# EAGLE board uSlices_v3 (EAGLE 9.3.1)
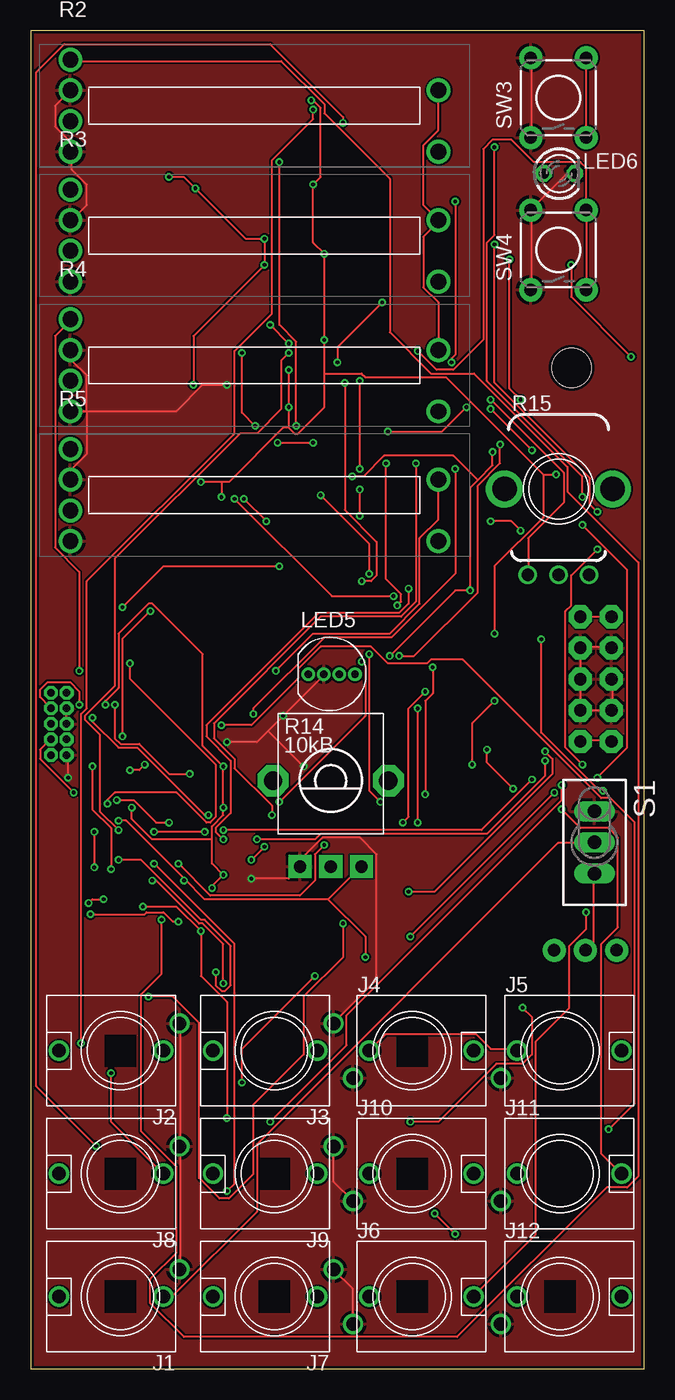
[diagram p3: board, top side]
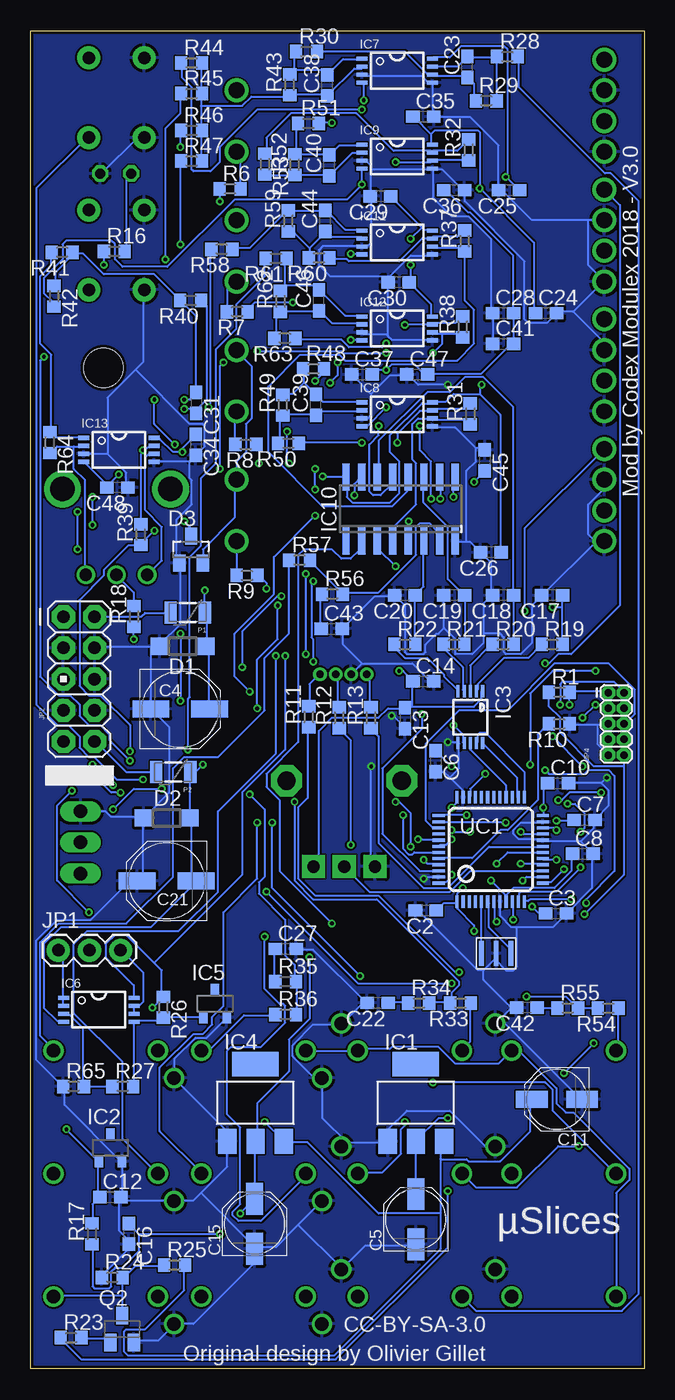
[diagram p4: board, bottom side, seen from below]

Size 50 x 109 mm. Coordinates in mm from the lower left corner, seen from the top.
Outline: 0,0 50,0 50,109 0,109 0,0
Copper layers (1*16): Top 0.035mm / dielectric 1.5mm / Bottom 0.035mm
Design rules "dirt_cheap_dirty_boards.v1.1": minimum track width 6mil, minimum drill 12mil, track to track 6mil, track to pad 6mil, pad to pad 6mil, via to via 6mil, smd to smd 0mil, copper to edge 10mil, drill to drill 10mil, minimum pad ring 10mil, minimum via ring 6mil, stop-mask expansion 2mil, vias tented up to drill 25mil, thermal gap 10mil
Holes 3.2 mm at 44.07,81.53

## Footprints (pad centres in the part's own frame; a part is rotated, then mirrored left to right if it is on the bottom)
C0603 = smd 1.1 x 1: 1 -0.85,0; 2 0.85,0
PANASONIC_D = smd 3 x 1.4: + 2.4,0; - -2.4,0
PANASONIC_C = smd 2.6 x 1.4: + 2.05,0; - -2.05,0
SOD123 = smd 1.4 x 1.4: A 1.9,0; C -1.9,0
SOT23 = smd 1 x 1.4: 1 -0.95,-1.1; 2 0.95,-1.1; 3 0,1.1
SOT223 = smd 1.499 x 2.007: 1 -2.261,-3.15; 2 0.025,-3.15; 3 2.311,-3.15 | smd 3.81 x 2.007: 4 0,3.15
DBZ_R-PDSO-G3 = smd 0.7 x 1: 1 -0.95,-1.1; 2 0.95,-1.1; 3 0,1.1
MSOP10 = smd 0.25 x 1: 1 -1,-2.113; 2 -0.5,-2.113; 3 0,-2.113; 4 0.5,-2.113; 5 1,-2.113; 6 1,2.113; 7 0.5,2.113; 8 0,2.113; 9 -0.5,2.113; 10 -1,2.113
TSSOP-8 = smd 0.9 x 0.35: 1 -2.875,0.975; 2 -2.875,0.325; 3 -2.875,-0.325; 4 -2.875,-0.975; 5 2.875,-0.975; 6 2.875,-0.325; 7 2.875,0.325; 8 2.875,0.975
SOIC16N = smd 0.6 x 2.2: 1 -4.445,-2.6; 2 -3.175,-2.6; 3 -1.905,-2.6; 4 -0.635,-2.6; 5 0.635,-2.6; 6 1.905,-2.6; 7 3.175,-2.6; 8 4.445,-2.6; 9 4.445,2.6; 10 3.175,2.6; 11 1.905,2.6; 12 0.635,2.6; 13 -0.635,2.6; 14 -1.905,2.6; 15 -3.175,2.6; 16 -4.445,2.6
INSTRUO_S_JACK_S2_INV = drill 1.1: GND 2.223,-4.826; NORM 0,-3.5; TIP 0,5
1X03 = drill 1.016 pad 1.88: 1 0,0; 2 2.54,0; 3 5.08,0
AVR_ICSP = drill 1.016 pad 1.88 octagon: 1 -1.27,5.08; 2 1.27,5.08; 3 -1.27,2.54; 4 1.27,2.54; 5 -1.27,0; 6 1.27,0; 7 -1.27,-2.54; 8 1.27,-2.54; 9 -1.27,-5.08; 10 1.27,-5.08
2X5-1.27 = drill 0.61 pad 1.067 octagon: 1 -1.27,3.81; 2 0,3.81; 3 -1.27,2.54; 4 0,2.54; 5 -1.27,1.27; 6 0,1.27; 7 -1.27,0; 8 0,0; 9 -1.27,-1.27; 10 0,-1.27
LED-TRICOLOR-THROUGHHOLE = drill 0.6: BLU 0.635,0; GND -0.635,0; GRN 1.905,0; RED -1.905,0
LED3MM = drill 0.813 octagon: A -1.27,0; K 1.27,0
PTC-1206 = smd 1 x 1.8: 1 -1.4,0; 2 1.4,0
INSTRUO_CRYSTAL_SMALLER = smd 0.4 x 2: GND 0,0; X1 -1.2,0; X2 1.2,0
SOT23-BEC = smd 1 x 1.4: B -0.95,-1.1; C 0,1.1; E 0.95,-1.1
R0603 = smd 1 x 1.1: 1 -0.85,0; 2 0.85,0
PTL2010G0103B2 = drill 1.3 pad 1.95: 1 2.5,3.75; 2 2.5,1.25; 3 2.5,-1.25; 4 2.5,-3.75; 5 32.5,-3.75; 6 32.5,1.25
ALPS_POT_VERTICAL_PS = drill 1 pad 1.88 square: P$1 -2.5,7; P$2 0,7; P$3 2.5,7 | drill 1.5 pad 2.54 octagon: P$4 -4.7,0; P$5 4.7,0
INSTRUO_Q-POT2 = drill 1 pad 1.5: P$1 -2.5,-7; P$2 0,-7; P$3 2.5,-7 | drill 2 pad 2.5: P$4 -4.4,0; P$5 4.4,0
TL3XPO = drill 1.1 pad 1.422 long: 1 -2.54,0; 2 0,0; 3 2.54,0
SPARKFUN_TACTILE-PTH = drill 1.016 pad 1.88: 1 -3.251,2.261; 2 3.251,2.261; 3 -3.251,-2.261; 4 3.251,-2.261
LQFP48 = smd 0.254 x 1: 1 -2.75,-4.25; 2 -2.25,-4.25; 3 -1.75,-4.25; 4 -1.25,-4.25; 5 -0.75,-4.25; 6 -0.25,-4.25; 7 0.25,-4.25; 8 0.75,-4.25; 9 1.25,-4.25; 10 1.75,-4.25; 11 2.25,-4.25; 12 2.75,-4.25; 25 2.75,4.25; 26 2.25,4.25; 27 1.75,4.25; 28 1.25,4.25; 29 0.75,4.25; 30 0.25,4.25; 31 -0.25,4.25; 32 -0.75,4.25; 33 -1.25,4.25; 34 -1.75,4.25; 35 -2.25,4.25; 36 -2.75,4.25 | smd 1 x 0.254: 13 4.25,-2.75; 14 4.25,-2.25; 15 4.25,-1.75; 16 4.25,-1.25; 17 4.25,-0.75; 18 4.25,-0.25; 19 4.25,0.25; 20 4.25,0.75; 21 4.25,1.25; 22 4.25,1.75; 23 4.25,2.25; 24 4.25,2.75; 37 -4.25,2.75; 38 -4.25,2.25; 39 -4.25,1.75; 40 -4.25,1.25; 41 -4.25,0.75; 42 -4.25,0.25; 43 -4.25,-0.25; 44 -4.25,-0.75; 45 -4.25,-1.25; 46 -4.25,-1.75; 47 -4.25,-2.25; 48 -4.25,-2.75

## Placement (x,y rotation side)
C2  100n  [C0603]  17.8,37.34 180 bottom
C3  100n  [C0603]  7.2,37.09 0 bottom
C4  47u  [PANASONIC_D]  37.81,53.74 0 bottom
C5  22u  [PANASONIC_C]  18.61,12.18 90 bottom
C6  100n  [C0603]  17,49.5 270 bottom
C7  100n  [C0603]  4.87,44.71 0 bottom
C8  3.3u  [C0603]  5.01,41.95 0 bottom
C10  100n  [C0603]  7.02,47.71 0 bottom
C11  22u  [PANASONIC_C]  7.12,21.94 180 bottom
C12  470n  [C0603]  43.5,14 0 bottom
C13  100n  [C0603]  19.5,53 270 bottom
C14  3.3u  [C0603]  18,56 0 bottom
C15  22u  [PANASONIC_C]  31.75,11.81 90 bottom
C16  100n  [C0603]  42,11 270 bottom
C17  1u  [C0603]  7.5,63 180 bottom
C18  1u  [C0603]  11.5,63 180 bottom
C19  1u  [C0603]  15.5,63 180 bottom
C20  1u  [C0603]  19.5,63 180 bottom
C21  47u  [PANASONIC_D]  38.92,39.74 180 bottom
C22  560p  [C0603]  21.73,29.8 180 bottom
C23  18p  [C0603]  14.41,106.03 90 bottom
C24  100n  [C0603]  8,86 0 bottom
C25  100n  [C0603]  11,96 180 bottom
C26  100n  [C0603]  12.5,66.5 180 bottom
C27  560p  [C0603]  29.22,34.21 0 bottom
C28  100n  [C0603]  11.5,86 0 bottom
C29  100n  [C0603]  21.5,95.5 180 bottom
C30  100n  [C0603]  20,88.5 180 bottom
C31  560p  [C0603]  36.52,78.68 270 bottom
C34  100n  [C0603]  36.55,75.27 270 bottom
C35  100n  [C0603]  18,102 0 bottom
C36  100n  [C0603]  15.5,96 180 bottom
C37  100n  [C0603]  23,81 0 bottom
C38  18p  [C0603]  25.83,104.53 90 bottom
C39  18p  [C0603]  26.75,78.53 90 bottom
C40  18p  [C0603]  25.67,98.03 90 bottom
C41  100n  [C0603]  11.5,83.5 0 bottom
C42  560p  [C0603]  9.57,29.42 180 bottom
C43  560p  [C0603]  25.47,60.29 0 bottom
C44  18p  [C0603]  26,93.5 90 bottom
C45  100n  [C0603]  13,74 270 bottom
C46  18p  [C0603]  26.51,87.03 90 bottom
C47  100n  [C0603]  18.5,81 0 bottom
C48  100n  [C0603]  42.92,71.79 180 bottom
D1  1N5819HW  [SOD123]  37.61,58.86 180 bottom
D2  1N5819HW  [SOD123]  38.91,44.86 0 bottom
D3  BAT54S  [SOT23]  36.93,66.74 0 bottom
IC1  LM1117-3.3  [SOT223]  18.63,21.68 0 bottom
IC2  LM4040B25  [DBZ_R-PDSO-G3]  43.5,18 0 bottom
IC3  DAC124S085CIMT  [MSOP10]  14.17,53.09 180 bottom
IC4  LM1117-3.3  [SOT223]  31.7,21.68 0 bottom
IC5  LM4040B10  [DBZ_R-PDSO-G3]  34.98,29.74 0 bottom
IC6  TL072TSSOP  [TSSOP-8]  44.45,29.24 0 bottom
IC7  TL072TSSOP  [TSSOP-8]  20.13,105.74 0 bottom
IC8  TL072TSSOP  [TSSOP-8]  20.13,77.74 0 bottom
IC9  TL072TSSOP  [TSSOP-8]  20.13,98.74 0 bottom
IC10  V2164SZ  [SOIC16N]  19.86,70.04 0 bottom
IC11  TL072TSSOP  [TSSOP-8]  20.13,91.74 0 bottom
IC12  TL072TSSOP  [TSSOP-8]  20.13,84.74 0 bottom
IC13  TL072TSSOP  [TSSOP-8]  42.81,74.86 0 bottom
J1  [INSTRUO_S_JACK_S2_INV]  7.31,5.88 90 top
J2  [INSTRUO_S_JACK_S2_INV]  7.31,25.91 90 top
J3  [INSTRUO_S_JACK_S2_INV]  19.86,25.91 90 top
J4  [INSTRUO_S_JACK_S2_INV]  31.09,25.91 270 top
J5  [INSTRUO_S_JACK_S2_INV]  43.14,25.91 270 top
J6  [INSTRUO_S_JACK_S2_INV]  31.09,5.88 270 top
J7  [INSTRUO_S_JACK_S2_INV]  19.86,5.88 90 top
J8  [INSTRUO_S_JACK_S2_INV]  7.31,15.89 90 top
J9  [INSTRUO_S_JACK_S2_INV]  19.86,15.89 90 top
J10  [INSTRUO_S_JACK_S2_INV]  31.09,15.89 270 top
J11  [INSTRUO_S_JACK_S2_INV]  43.14,15.89 270 top
J12  [INSTRUO_S_JACK_S2_INV]  43.14,5.88 270 top
JP1  [1X03]  47.75,34.09 0 bottom
JP2  M05X2PTH  [AVR_ICSP]  46.06,56.18 0 bottom
JP4  M05X2MINIJTAG  [2X5-1.27]  1.66,51.27 0 bottom
LED5  WP154A4SUREQBFZG  [LED-TRICOLOR-THROUGHHOLE]  24.52,56.58 0 top
LED6  [LED3MM]  43.07,97.37 0 top
P1  PTCSMD  [PTC-1206]  37.2,61.61 180 bottom
P2  PTCSMD  [PTC-1206]  38.38,48.61 180 bottom
Q1  8MHz  [INSTRUO_CRYSTAL_SMALLER]  12.07,33.84 0 bottom
Q2  MMBT3904  [SOT23-BEC]  42.55,3.24 0 bottom
R1  10k  [R0603]  6.93,55.11 0 bottom
R2  PTL20-10G0-103B2  [PTL2010G0103B2]  0.74,102.89 0 top
R3  PTL20-10G0-103B2  [PTL2010G0103B2]  0.74,92.32 0 top
R4  PTL20-10G0-103B2  [PTL2010G0103B2]  0.74,81.74 0 top
R5  PTL20-10G0-103B2  [PTL2010G0103B2]  0.74,71.17 0 top
R6  100  [R0603]  33.75,96.11 0 bottom
R7  100  [R0603]  33.17,86.11 180 bottom
R8  100  [R0603]  32.48,75.29 180 bottom
R9  100  [R0603]  32.38,64.62 180 bottom
R10  10k  [R0603]  6.93,52.53 180 bottom
R11  100  [R0603]  27.33,53.11 90 bottom
R12  100  [R0603]  24.85,53.03 90 bottom
R13  100  [R0603]  22.27,53.03 90 bottom
R14  10kB  [ALPS_POT_VERTICAL_PS]  24.45,47.91 180 top
R15  10kB CD  [INSTRUO_Q-POT2]  43.01,71.67 0 top
R16  100  [R0603]  43.19,91.03 0 bottom
R17  510  [R0603]  45,11 90 bottom
R18  100k  [R0603]  41.57,61.29 90 bottom
R19  100  [R0603]  7.5,59 0 bottom
R20  100  [R0603]  11.5,59 0 bottom
R21  100  [R0603]  15.5,59 0 bottom
R22  100  [R0603]  19.5,59 0 bottom
R23  10k  [R0603]  46.71,2.53 0 bottom
R24  3.3k  [R0603]  43.35,7.45 0 bottom
R25  4.7k  [R0603]  38.27,8.45 0 bottom
R26  4.7k  [R0603]  39.19,29.45 270 bottom
R27  100k  [R0603]  42.5,23 0 bottom
R28  1.0k  [R0603]  11.16,106.88 0 bottom
R29  100k  [R0603]  12.87,103.29 0 bottom
R30  100k  [R0603]  27.52,107.29 0 bottom
R31  100k  [R0603]  14.17,77.79 90 bottom
R32  100k  [R0603]  14.32,99.29 90 bottom
R33  100k  [R0603]  14.97,29.79 180 bottom
R34  510  [R0603]  18.38,29.79 0 bottom
R35  510  [R0603]  29.22,31.53 0 bottom
R36  100k  [R0603]  29.22,28.87 0 bottom
R37  100k  [R0603]  14.64,91.87 90 bottom
R38  100k  [R0603]  14.79,84.87 90 bottom
R39  1.0k  [R0603]  41.03,67.95 90 bottom
R40  33k  [R0603]  36.97,87.03 180 bottom
R41  100k  [R0603]  47.44,90.95 180 bottom
R42  240k  [R0603]  48.09,87.37 270 bottom
R43  49.9k  [R0603]  28.9,104.59 90 bottom
R44  100k  [R0603]  36.89,106.37 0 bottom
R45  100k  [R0603]  36.89,103.87 0 bottom
R46  100k  [R0603]  36.89,100.87 0 bottom
R47  100k  [R0603]  36.89,98.37 0 bottom
R48  1.0k  [R0603]  26.95,81.45 0 bottom
R49  100k  [R0603]  29.45,78.5 90 bottom
R50  100k  [R0603]  29,75.38 180 bottom
R51  1.0k  [R0603]  27.37,101.45 0 bottom
R52  100k  [R0603]  28.5,98.09 90 bottom
R53  100k  [R0603]  30.91,98.12 270 bottom
R54  100k  [R0603]  2.94,29.37 180 bottom
R55  510  [R0603]  6.24,29.37 0 bottom
R56  510  [R0603]  25.41,63.11 0 bottom
R57  100k  [R0603]  28.09,65.87 0 bottom
R58  1.0k  [R0603]  34.43,91.2 180 bottom
R59  100k  [R0603]  29,93.5 90 bottom
R60  100k  [R0603]  26.5,90.5 180 bottom
R61  1.0k  [R0603]  30,90.46 180 bottom
R62  100k  [R0603]  29.64,86.95 90 bottom
R63  100k  [R0603]  29.29,83.95 180 bottom
R64  100k  [R0603]  48.44,75.45 270 bottom
R65  100k  [R0603]  46.5,23 0 bottom
S1  TL32PO  [TL3XPO]  45.94,42.88 270 top
SW3  [SPARKFUN_TACTILE-PTH]  43.01,103.54 90 top
SW4  [SPARKFUN_TACTILE-PTH]  43.01,91.14 90 top
UC1  STM32F103CBT6  [LQFP48]  12.51,42.31 0 bottom

## Tracks (layer width: path | path; a pad name or v marks a point on that pad's centre or on a via)
+3V3  (via drill 0.3)
  Top 0.152: v14.78,39.17 14.78,39.32 v15.7,40.23 14.78,41.15 14.78,43.13 | 14.78,43.13 14.78,44.2 15.7,45.11 v15.7,45.72 v15.7,49.07 14.02,50.75 14.02,58.22 9.91,62.33 9.6,62.33 7.16,59.89 7.16,55.47 6.1,54.41 v6.1,54.1 | v9.14,37.64 11.89,37.64 v13.87,35.66 13.87,32 16,29.87 v16,20.42 | v8.23,45.72 8.23,44.81 9.91,43.13 14.78,43.13
  Bottom 0.152: C5.+ 18.59,14.33 18.59,18.44 IC1.2 18.59,18.59 16.76,20.42 v16,20.42 | JP4.1 3.05,55.17 5.94,55.17 R1.2 6.1,55.02 v6.1,54.1 | UC1.24 8.23,45.11 v8.23,45.72 8.23,47.4 7.92,47.7 C10.1 | 15.24,37.95 16.31,37.95 16.92,37.34 C2.1 | 15.24,37.95 UC1.1 | v15.7,40.23 15.7,40.08 16.15,39.62 16.61,39.62 UC1.48 | v14.78,39.17 15.24,38.71 15.24,38.1 UC1.1 | v15.7,45.72 15.24,46.18 15.24,46.48 UC1.36 | v9.14,37.64 8.69,37.19 8.08,37.19 C3.1 | v13.87,35.66 13.87,36.12 15.24,37.49 15.24,37.95 | 15.24,37.95 UC1.1 | v15.7,49.07 16.92,50.29 C6.1
+3V3_A  (via drill 0.3)
  Top 0.152: R4.6 33.22,83.06 33.22,86.87 32,88.09 32,92.2 33.22,93.42 R3.6 33.22,93.57 32,94.79 32,99.67 33.22,100.89 33.22,104.09 R2.6 | v32.92,12.65 v34.59,10.97 | v7.16,44.65 7.77,44.65 12.5,39.93 | 12.5,39.93 14.17,38.25 24.23,38.25 | 24.23,38.25 26.82,40.84 R14.P$1 | 12.5,39.93 v12.5,39.78 | v27.28,33.53 27.28,35.2 24.23,38.25 | v19.96,56.84 23.01,59.89 29.26,59.89 31.7,62.33 31.7,67.67 33.22,69.19 33.22,72.39 R5.6
  Bottom 0.152: D3.2 35.97,65.68 35.97,66.75 33.38,69.34 33.38,72.39 R5.6 33.22,72.54 33.22,73.91 32.46,74.68 32.46,76.96 32,77.42 32,81.69 33.22,82.91 R4.6 | 41.15,10.97 41.91,11.73 C16.1 | 41.15,10.97 41.15,9.6 42.52,8.23 43.13,8.23 43.43,7.92 43.43,6.71 43.59,6.55 44.81,6.55 44.96,6.71 44.96,10.06 R17.1 | v34.59,10.97 41.15,10.97 | v32.92,12.65 31.85,13.72 C15.+ 31.7,13.87 31.7,18.44 IC4.2 31.55,18.59 31.55,21.64 28.96,24.23 28.96,26.82 27.28,28.5 v27.28,33.53 | 11.28,38.56 11.28,38.1 UC1.9 11.28,38.56 | 11.28,38.56 10.67,39.17 7.32,39.17 5.94,40.54 5.94,41.91 C8.1 | 18.9,53.95 19.36,53.95 C13.1 19.51,53.8 20.88,53.8 21.64,53.03 25.45,53.03 26.52,51.97 26.52,41.3 26.82,41 R14.P$1 | 18.9,53.95 13.87,53.95 13.26,54.56 13.26,55.17 IC3.1 | 18.9,53.95 18.9,55.93 C14.1 18.9,56.08 19.66,56.84 v19.96,56.84 | v7.16,44.65 5.79,44.65 C7.1 | v12.5,39.78 11.28,38.56
ADD_SWITCH  (via drill 0.3)
  Top 0.152: v14.17,43.74 v10.06,43.74 | v15.7,43.89 36.73,43.89 v40.84,48.01 | SW3.4 45.26,106.68 45.26,100.43 SW3.3
  Bottom 0.152: v10.06,43.74 9.91,43.59 8.38,43.59 UC1.21 | v14.17,43.74 15.54,43.74 v15.7,43.89 | v40.84,48.01 42.98,48.01 44.81,49.84 45.26,49.84 46.02,50.6 46.02,51.51 46.94,52.43 47.85,52.43 49.53,54.1 49.53,96.16 45.41,100.28 SW3.3
AREF_2.5  (via drill 0.3)
  Top 0.152: v15.54,52.43 17.98,52.43 21.79,56.24 21.79,57 23.62,58.83 27.74,58.83 29.11,57.45 32.31,57.45 32.61,57.76 35.2,57.76 46.48,46.48 47.24,46.48 49.23,44.5 49.23,21.64 v47.09,19.51
  Bottom 0.152: v15.54,52.43 14.78,51.66 14.78,51.05 IC3.7 | v47.09,19.51 44.5,16.92 IC2.1 44.5,16.76 44.5,14.02 C12.1 44.5,13.87 44.96,13.41 44.96,11.89 R17.2
AREF_5
  Bottom 0.152: IC6.2 47.4,29.57 47.4,30.18 IC6.1 47.4,30.33 47.4,33.68 47.7,33.98 JP1.1
AREF_10
  Bottom 0.152: IC6.6 41.6,28.96 41.6,29.41 IC6.7 41.45,29.57 41.15,29.57 40.84,29.87 40.84,32.31 42.52,33.98 JP1.3
AREF_10_0
  Bottom 0.152: IC5.1 35.97,28.65 39.17,28.65 R26.2 39.32,28.5 39.47,28.35 41.45,28.35 IC6.5 41.6,28.19 41.6,23.01 R27.2
BOOT_FLASH
  Bottom 0.152: UC1.44 16.61,41.6 14.02,41.6 11.73,43.89 11.12,43.89 8.69,46.33 8.69,51.66 7.92,52.43 R10.2
DAC_MOSI
  Bottom 0.152: UC1.28 11.28,46.63 11.28,47.55 14.17,50.44 14.17,50.9 IC3.8
DAC_SCK
  Bottom 0.152: UC1.26 10.36,46.63 10.36,48.16 13.11,50.9 IC3.10
DAC_SS
  Bottom 0.152: UC1.25 9.75,46.63 9.75,48.62 12.95,51.82 13.41,51.82 13.56,51.66 13.56,51.05 IC3.9
DEL_SWITCH  (via drill 0.3)
  Top 0.152: v7.16,43.89 5.64,45.41 5.64,51.66 4.42,52.88 4.42,53.19 6.86,55.63 6.86,65.99 17.07,76.2 18.44,76.2 20.42,78.18 20.42,82.14 v21.03,82.75 | v31.55,82.91 33.07,81.38 34.44,81.38 36.88,83.82 36.88,99.36 37.64,100.13 39.17,100.13 41,98.3 44.81,98.3 45.26,97.84 45.26,94.49 SW4.4 45.26,94.34 45.26,87.94 SW4.3
  Bottom 0.152: v7.16,43.89 7.32,44.04 8.23,44.04 UC1.22 | v21.03,82.75 24.54,82.75 24.69,82.91 v31.55,82.91
FB_CURRENT  (via drill 0.3)
  Top 0.152: v9.6,30.33 11.58,30.33 13.72,28.19 13.72,15.54 15.39,13.87 16.15,13.87 18.14,15.85 18.14,21.49 22.25,25.6 22.25,30.33 25.45,33.53 v25.45,36.27
  Bottom 0.152: R54.2 3.81,29.41 5.33,29.41 R55.2 5.49,29.41 6.4,30.33 v9.6,30.33 | v25.45,36.27 29.72,40.54 29.72,46.33 30.79,47.4 30.79,48.46 28.19,51.05 28.19,66.29 27.74,66.75 25.45,66.75 24.69,65.99 23.93,65.99 23.16,66.75 23.16,67.36 IC10.2
FB_CURRENT1  (via drill 0.3)
  Top 0.152: v28.5,46.18 27.58,47.09 v27.58,58.22 | v27.58,64.77 27.58,67.21 v23.62,71.17
  Bottom 0.152: R34.2 17.53,29.87 15.85,29.87 R33.2 15.7,29.87 15.7,30.63 15.09,31.24 15.09,31.55 21.79,38.25 26.98,38.25 28.5,39.78 v28.5,46.18 | v27.58,64.77 v27.58,58.22 | v23.62,71.17 23.62,72.08 23.16,72.54 IC10.15
FB_CURRENT2  (via drill 0.3)
  Top 0.152: v32.16,46.79 32.16,54.41 32.77,55.02 v32.77,57.15 | v29.57,62.94 24.54,62.94 v16.61,70.87
  Bottom 0.152: R36.2 28.35,28.96 28.35,31.39 R35.2 28.5,31.55 28.5,32.92 29.26,33.68 29.26,36.58 31.39,38.71 31.39,39.62 30.94,40.08 30.94,45.57 v32.16,46.79 | v32.77,57.15 32.77,60.05 29.87,62.94 v29.57,62.94 | v16.61,70.87 16.61,72.54 IC10.10
FB_CURRENT3
  Bottom 0.152: R57.2 27.28,65.84 24.69,63.25 R56.2 24.54,63.25 21.64,63.25 18.59,66.29 18.59,68.58 18.29,68.89 17.53,68.89 16.76,68.12 16.76,67.51 IC10.7
FRAME_CHANGE  (via drill 0.3)
  Top 0.152: v10.06,41.15 16.61,34.59 16.61,15.09 v16,14.48
  Bottom 0.152: v10.06,41.15 8.38,41.15 UC1.16 | v16,14.48 16,9.91 25.15,0.76 45.87,0.76 47.55,2.44 R23.1
GAIN_1  (via drill 0.3)
  Top 0.152: v20.27,65.38 10.82,65.38 v7.47,62.03
  Bottom 0.152: 6.71,62.03 6.71,62.94 C17.1 | 6.71,62.03 6.71,59.13 R19.2 | v20.27,65.38 21.64,66.75 21.64,67.36 IC10.3 | 6.71,62.03 v7.47,62.03
GAIN_2
  Bottom 0.152: R20.2 10.67,59.13 10.67,62.94 C18.1 10.67,63.09 10.67,78.33 13.11,80.77 14.63,80.77 15.85,79.55 17.68,79.55 21.64,75.59 21.64,72.69 IC10.14
GAIN_3
  Bottom 0.152: R21.2 14.63,59.13 14.63,62.94 C19.1 14.78,63.09 16,64.31 16,68.58 17.98,70.56 17.98,72.54 IC10.11
GAIN_4
  Bottom 0.152: R22.2 18.75,59.13 18.75,62.94 C20.1 18.59,63.09 17.98,63.7 17.98,67.36 IC10.6
GND  (via drill 0.3)
  Top 0.152: LED5.GND 23.93,56.54 v20.57,53.19 19.36,51.97 | v16,51.05 18.44,51.05 19.36,51.97 | R2.2 3.2,104.09 1.98,102.87 1.98,101.19 3.2,99.97 3.2,99.21 R2.4 3.35,99.06 3.35,97.69 4.57,96.47 4.57,94.79 3.35,93.57 R3.2 | v16,80.16 14.02,80.16 11.89,78.03 4.57,78.03 | 4.57,78.03 3.35,78.03 R4.4 | 4.57,78.03 4.57,80.92 3.35,82.14 3.35,82.91 R4.2 | 4.57,78.03 4.57,74.52 3.35,73.3 3.35,72.54 R5.2 | LED6.K 44.2,97.23 43.59,97.23 40.84,94.49 SW4.2 40.84,94.34 40.84,87.94 SW4.1 | SW3.2 40.84,106.68 40.84,100.43 SW3.1 | 44.81,53.65 44.81,56.08 JP2.6 44.81,56.24 44.81,58.67 JP2.4 44.81,58.83 47.24,58.83 JP2.3 | 44.81,53.65 JP2.8 44.81,53.65 | JP2.5 47.4,56.08 47.4,53.65 JP2.7 47.24,53.65 44.81,53.65 | JP4.3 2.9,53.8 2.9,52.58 JP4.5 | v3.05,48.16 3.05,49.99 JP4.9 | J1.GND 12.19,8.23 12.19,17.98 J8.GND 12.19,18.14 12.19,28.04 J2.GND | v17.98,39.93 21.03,39.93 21.95,40.84 R14.P$3 22.1,41 22.1,41.6 23.77,43.28 26.82,43.28 28.19,41.91 28.19,31.7 24.69,28.19 J3.GND | J6.GND 26.21,3.66 26.21,6.55 24.69,8.08 J7.GND | J9.GND 24.69,17.98 24.69,15.24 26.21,13.72 J10.GND | v22.25,49.07 19.36,51.97
  Bottom 0.152: 13.72,74.98 15.39,76.66 17.22,76.66 IC8.5 | 13.72,74.98 13.11,74.98 C45.1 | 16.31,60.35 16.31,62.94 C19.2 | 16.31,60.35 15.39,59.44 15.39,58.22 14.02,58.22 13.11,59.13 13.11,59.89 | 13.11,59.89 13.11,62.33 12.5,62.94 C18.2 12.5,63.09 12.5,65.68 13.26,66.45 C26.2 13.41,66.6 14.17,67.36 14.48,67.36 | 14.48,67.36 15.39,67.36 IC10.8 | 13.72,74.98 13.72,73.91 14.48,73.15 14.48,67.36 | 15.85,48.16 16.31,48.62 16.92,48.62 C6.2 | 15.85,48.16 14.78,47.09 14.78,46.63 UC1.35 | 15.85,48.16 15.09,48.92 15.09,50.9 IC3.6 15.24,51.05 v16,51.05 | 23.01,57.45 18.9,57.45 17.53,56.08 17.22,56.08 C14.2 | 23.01,57.45 23.77,56.69 LED5.GND | v20.57,53.19 20.42,53.19 19.51,52.27 C13.2 | 23.01,57.45 24.54,58.98 24.54,60.2 C43.2 24.54,60.35 21.95,62.94 20.42,62.94 C20.2 20.27,62.94 19.51,62.18 19.51,58.37 19.36,58.22 17.98,58.22 17.83,58.37 17.83,58.98 16.92,59.89 16.76,59.89 16.31,60.35 | IC7.3 22.86,105.31 18.14,105.31 17.68,104.85 17.37,104.85 IC7.5 17.22,104.7 17.22,102.11 C35.2 17.07,101.96 14.17,101.96 11.89,99.67 11.89,96.01 C25.2 11.73,95.86 11.43,95.86 9.14,93.57 4.57,93.57 | 4.57,93.57 3.35,93.57 R3.2 | 20.73,89 19.05,90.68 17.37,90.68 IC11.5 | 20.73,89 20.73,88.54 C30.2 20.88,88.39 20.88,84.12 | 20.88,84.12 21.03,84.28 22.86,84.28 IC12.3 | 20.88,84.12 20.57,83.82 17.37,83.82 IC12.5 | 22.25,97.69 22.25,95.56 C29.2 22.25,95.4 22.25,91.75 22.55,91.44 22.86,91.44 IC11.3 23.01,91.44 26.21,91.44 26.52,91.14 26.52,89.92 25.6,89 20.73,89 | 22.25,97.69 22.25,97.99 22.55,98.3 22.86,98.3 IC9.3 | C41.1 12.34,83.52 12.34,85.95 C28.1 12.5,86.11 12.5,92.05 14.33,93.88 15.7,93.88 17.22,95.4 17.22,97.69
  Bottom 0.152: 17.22,97.69 16.46,97.69 14.78,96.01 C36.1 14.63,95.86 14.63,95.1 9.75,90.22 9.75,85.5 9.45,85.19 7.92,85.19 7.16,85.95 C24.2 7.01,86.11 5.79,86.11 | 17.22,97.69 IC9.5 | 17.22,97.69 IC9.5 | 22.25,97.69 17.37,97.69 IC9.5 | 3.96,67.36 8.23,63.09 C17.2 8.38,62.94 9.14,62.18 9.14,59.13 10.06,58.22 11.28,58.22 11.43,58.37 11.43,59.59 11.73,59.89 13.11,59.89 | 3.96,67.36 3.35,67.36 R5.4 3.96,67.36 | 3.96,67.36 4.57,67.97 4.57,70.41 3.35,71.63 3.35,72.39 R5.2 | 5.79,86.11 3.35,88.54 R3.4 3.35,88.7 4.57,89.92 4.57,93.57 | 5.79,86.11 3.35,83.67 3.35,83.06 R4.2 | 22.25,79.4 22.25,77.72 22.55,77.42 22.86,77.42 IC8.3 | 22.25,79.4 23.77,80.92 C37.1 | 22.25,79.4 20.73,80.92 19.36,80.92 C47.1 19.2,80.92 18.44,80.16 v16,80.16 | SW3.1 40.84,100.28 41.3,100.28 44.2,97.38 LED6.K | 43.74,74.52 45.57,74.52 IC13.3 | 43.74,74.52 42.22,73 42.22,71.93 C48.1 | 43.74,74.52 43.74,79.1 41.45,81.38 | 41.45,81.38 40.84,81.99 40.84,87.78 SW4.1 | D2.C 40.84,44.81 40.84,40.23 41.3,39.78 C21.+ 41.45,39.62 42.06,39.62 45.11,36.58 47.85,36.58 49.53,34.9 49.53,25.15 47.4,23.01 R65.1 47.24,22.86 47.24,21.49 42.67,16.92 IC2.2 42.52,16.76 42.52,14.02 C12.2 | S1.1 45.87,45.41 43.89,45.41 43.43,44.96 40.84,44.96 D2.C | 37.03,73.91 39.93,73.91 IC13.5 | 37.03,73.91 36.58,74.37 C34.2 | 40.23,58.83 44.65,58.83 JP2.4 | 40.23,58.83 39.62,58.83 D1.A 39.47,58.98 37.8,60.66 37.8,65.53 D3.1 37.95,65.68 38.1,65.84 38.1,69.19 36.88,70.41 36.88,72.39 37.03,72.54 37.03,73.91 | 37.03,73.91 C34.2 | 40.23,58.83 40.23,53.8 C4.- 40.08,53.65 38.71,52.27 38.71,46.94 40.69,44.96 D2.C | 41.45,81.38 37.03,76.96 35.97,76.96 35.81,76.81 35.81,75.13 36.42,74.52 C34.2
  Bottom 0.152: 3.81,52.43 3.05,52.43 JP4.5 | 3.81,52.43 5.94,52.43 R10.1 | 3.81,52.43 3.81,50.9 3.05,50.14 JP4.9 | 10.36,35.97 7.47,35.97 6.4,37.03 C3.2 6.25,37.19 4.27,39.17 4.27,41.91 C8.2 4.27,42.06 5.18,42.98 | 10.36,35.97 10.82,35.97 11.73,36.88 11.73,37.95 UC1.8 | 5.18,42.98 8.23,42.98 UC1.20 8.38,43.13 10.21,43.13 10.67,43.59 10.67,43.89 10.06,44.5 8.38,44.5 UC1.23 | 5.18,42.98 4.12,44.04 4.12,44.65 C7.2 3.96,44.81 2.9,45.87 2.9,47.09 3.5,47.7 | 3.5,47.7 6.1,47.7 C10.2 | 3.5,47.7 v3.05,48.16 | 13.11,32.46 13.56,32.46 18.29,37.19 18.59,37.19 C2.2 | 12.19,33.38 13.11,32.46 | 12.19,33.38 12.19,33.83 Q1.GND 12.19,33.38 | 10.82,29.41 10.52,29.41 C42.2 10.82,29.41 | 11.73,28.5 12.04,28.19 J2.GND 11.73,28.5 | 11.73,28.5 10.82,29.41 | 11.73,28.5 5.18,21.95 C11.- | 13.11,32.46 13.11,31.7 10.82,29.41 | 10.36,35.97 10.36,32.77 10.67,32.46 11.28,32.46 12.19,33.38 | IC5.2 34.14,28.5 35.66,26.98 36.58,26.98 38.25,25.3 38.25,23.77 J5.GND 38.25,23.62 33.98,19.36 33.98,18.59 IC4.1 33.98,18.44 33.98,16.46 36.12,14.33 | R24.1 44.35,7.47 42.06,9.75 42.06,10.06 C16.2 42.06,10.21 42.06,10.52 42.82,11.28 42.82,13.72 42.67,13.87 C12.2 | C12.2 42.52,13.87 42.37,13.72 38.41,13.72 J11.GND 38.25,13.72 36.73,13.72 36.12,14.33 | v17.98,39.93 17.83,40.08 16.76,40.08 UC1.47 | C27.2 28.35,34.14 26.98,34.14 22.71,29.87 C22.2 22.71,29.72 23.01,29.72 24.54,28.19 J3.GND 24.69,28.04 26.98,28.04 28.65,26.36 28.65,25.45 26.98,23.77 26.36,23.77 J4.GND 26.21,23.62 26.21,20.42 24.23,18.44 | C5.- 18.75,10.06 22.71,10.06 24.54,8.23 J7.GND 24.69,8.23 28.19,11.73 | 24.23,18.44 21.03,18.44 IC1.1 20.88,18.59 20.88,19.51 19.36,21.03 15.85,21.03 12.95,18.14 12.19,18.14 J8.GND
  Bottom 0.152: 24.23,18.44 24.54,18.14 J9.GND 24.23,18.44 | Q2.E 41.45,2.29 39.62,2.29 38.41,3.5 J12.GND 38.25,3.66 36.73,3.66 31.85,8.53 31.85,9.75 C15.- | 31.7,9.91 30.02,9.91 28.19,11.73 | 28.19,11.73 26.36,13.56 J10.GND | 31.7,9.91 C15.- | 31.7,9.91 36.12,14.33 | 31.7,9.91 C15.- | v22.25,49.07 22.25,41.15 22.1,41 R14.P$3
  pour Top (isolate 0.012): 50,109 0,109 0,0 50,0
  pour Bottom (isolate 0.012): 50,109 0,109 0,0 50,0
IN_1
  Bottom 0.152: R54.1 2.13,29.26 2.13,26.21 2.29,26.06 J2.TIP
IN_2
  Bottom 0.152: R33.1 14.17,29.72 14.17,26.67 14.78,26.06 J3.TIP
IN_3
  Bottom 0.152: R36.1 30.18,28.8 32.61,28.8 35.36,26.06 35.97,26.06 J4.TIP
IN_4
  Bottom 0.152: R57.1 28.96,65.84 28.96,59.89 30.94,57.91 30.94,53.65 34.75,49.84 37.49,49.84 38.41,48.92 38.41,40.08 42.22,36.27 47.7,36.27 49.23,34.75 49.23,27.13 48.16,26.06 J5.TIP
JTCK  (via drill 0.3)
  Top 0.152: v14.48,45.11 14.17,45.11 8.69,50.6 7.16,50.6 5.03,52.73 v5.03,53.03 | v3.96,54.1 3.96,55.17 3.2,55.93 1.37,55.93 0.76,55.32 0.76,54.71 1.52,53.95 JP4.4
  Bottom 0.152: v14.48,45.11 16.61,45.11 UC1.37 | v3.96,54.1 v5.03,53.03
JTDI  (via drill 0.3)
  Top 0.152: v11.28,44.5 10.21,44.5 8.38,46.33 v7.01,46.33 | v3.5,46.94 0.76,49.68 0.76,50.44 1.52,51.21 JP4.8
  Bottom 0.152: v11.28,44.5 16.61,44.5 UC1.38 | v7.01,46.33 6.71,46.33 6.1,46.94 v3.5,46.94
JTDO
  Bottom 0.152: UC1.39 16.76,44.04 17.22,44.04 17.83,44.65 17.83,50.9 15.09,53.65 11.12,53.65 7.32,57.45 2.9,57.45 0.76,55.32 0.76,53.34 1.52,52.58 JP4.6
JTMS  (via drill 0.3)
  Top 0.152: v12.95,48.46 11.28,48.46 8.84,50.9 7.32,50.9 6.86,51.36 v6.86,54.1
  Bottom 0.152: v12.95,48.46 14.17,47.24 14.17,46.63 UC1.34 | v6.86,54.1 6.86,55.78 6.71,55.93 2.44,55.93 1.68,55.17 JP4.2
LED_B  (via drill 0.3)
  Top 0.152: v12.04,41.15 14.63,38.56 21.95,38.56 23.16,39.78 23.16,41.91 v23.93,42.67
  Bottom 0.152: v12.04,41.15 11.12,42.06 8.38,42.06 UC1.18 | v23.93,42.67 23.93,51.21 24.84,52.12 R12.1
LED_CH1  (via drill 0.3)
  Top 0.152: v18.14,53.34 18.14,53.8 23.93,59.59 29.41,59.59 34.59,64.77 v34.59,73.3 | v34.29,81.99 34.29,82.3 34.59,82.6 v34.59,95.1
  Bottom 0.152: v18.14,53.34 18.14,52.12 21.34,48.92 21.34,43.59 18.29,40.54 16.76,40.54 UC1.46 | v34.59,73.3 34.59,81.69 v34.29,81.99 | v34.59,95.1 34.59,96.01 R6.1
LED_CH2  (via drill 0.3)
  Top 0.152: v19.05,42.52 v17.98,41.45 | v20.27,46.18 27.28,53.19 27.28,57.3 v26.98,57.61 | v26.98,64.16 27.74,64.16 28.19,64.62 28.19,67.36 25.6,69.95 v25.6,80.31 | v24.99,81.99 24.99,83.21 v28.65,86.87
  Bottom 0.152: v17.98,41.45 17.68,41.15 16.76,41.15 UC1.45 | v19.05,42.52 19.05,45.26 19.96,46.18 v20.27,46.18 | v26.98,57.61 26.98,59.44 27.13,59.59 27.13,64.01 v26.98,64.16 | v25.6,80.31 24.99,80.92 v24.99,81.99 | v28.65,86.87 31.7,86.87 32.31,86.26 R7.1
LED_CH3  (via drill 0.3)
  Top 0.152: v19.66,45.11 19.66,45.87 16.61,48.92 16.61,49.68 14.94,51.36 14.94,52.58 23.62,61.27 30.18,61.27 31.39,62.48 v31.39,73.76
  Bottom 0.152: v19.66,45.11 19.66,42.37 19.2,41.91 18.9,41.91 18.75,42.06 UC1.43 | v31.39,73.76 31.39,75.13 31.55,75.29 R8.1
LED_CH4  (via drill 0.3)
  Top 0.152: v15.7,43.13 15.09,43.74 15.09,44.04 16.31,45.26 16.31,49.53 14.33,51.51 14.33,52.43 23.47,61.57 30.02,61.57 30.79,62.33 v30.79,63.55
  Bottom 0.152: v15.7,43.13 16.15,42.67 16.61,42.67 UC1.42 | v30.79,63.55 30.79,64.01 31.39,64.62 R9.1
LED_FRAME  (via drill 0.3)
  Top 0.152: v18.44,43.13 23.16,43.13 23.62,43.59 37.19,43.59 41.91,48.31 v41.91,49.53 | v48.92,82.45 44.04,87.33 v44.04,89.92
  Bottom 0.152: v18.44,43.13 16.76,43.13 UC1.41 | v41.91,49.53 43.59,51.21 43.59,51.66 44.35,52.43 45.26,52.43 46.02,53.19 46.02,54.1 46.79,54.86 47.7,54.86 49.23,56.39 49.23,82.14 v48.92,82.45 | v44.04,89.92 44.04,90.98 R16.1
LED_G  (via drill 0.3)
  Top 0.152: v7.16,41.45 8.99,41.45 13.87,36.58 14.17,36.58 16.31,34.44 16.31,31.24 15.85,30.79 15.54,30.79 15.09,31.24 v15.09,32.31
  Bottom 0.152: v7.16,41.45 8.23,41.45 UC1.17 | v15.09,32.31 15.39,32.31 21.64,38.56 26.82,38.56 28.19,39.93 28.19,45.72 27.43,46.48 27.43,52.12 R11.1
LED_R
  Bottom 0.152: UC1.19 8.38,42.52 12.65,42.52 16,39.17 17.98,39.17 21.64,42.82 21.64,51.51 22.25,52.12 R13.1
MODULATION  (via drill 0.3)
  Top 0.152: v9.91,39.78 10.21,39.78 13.72,36.27 14.02,36.27 15.7,34.59 v15.7,31.39 | v30.79,38.86 32.92,38.86 42.52,48.46 42.52,49.68 v41.91,50.29 | v37.49,69.04 39.17,69.04 v39.93,68.28
  Bottom 0.152: v9.91,39.78 9.6,40.08 8.38,40.08 UC1.14 | v15.7,31.39 23.32,31.39 v30.79,38.86 | v41.91,50.29 41.91,52.43 44.35,54.86 45.26,54.86 46.02,55.63 46.02,62.64 44.04,64.62 44.04,65.08 42.06,67.06 41.15,67.06 R39.1 41,67.21 v39.93,68.28 | v37.49,69.04 37.03,68.58 37.03,67.97 D3.3
N$1
  Bottom 0.152: 46.48,75.13 47.85,75.13 48.31,74.68 R64.2 | 46.48,75.13 45.72,75.13 IC13.2 | 46.48,75.13 46.48,73.3 45.57,72.39 45.57,64.77 R15.P$3
N$2
  Bottom 0.152: R55.1 7.16,29.41 8.69,29.41 C42.1
N$3
  Bottom 0.152: R28.2 10.21,106.83 10.21,104.39 3.2,97.38 2.74,97.38 0.46,95.1 0.46,6.1 1.83,4.72 13.72,4.72 14.78,5.79 J7.TIP
N$4
  Bottom 0.152: R32.2 14.33,100.13 15.24,99.21 17.22,99.21 IC9.7 17.37,99.21 20.42,99.21 23.47,102.26 28.8,102.26 30.79,100.28 30.79,99.06 R53.1
N$5
  Bottom 0.152: R18.2 41.6,62.18 41.6,63.25 42.98,64.62 R15.P$2
N$6
  Bottom 0.152: R6.2 32.92,96.16 32.92,98.75 33.22,99.06 R2.5
N$7
  Bottom 0.152: UC1.5 13.26,37.95 13.26,33.98 Q1.X1
N$8
  Bottom 0.152: UC1.6 12.65,37.95 12.65,35.97 10.97,34.29 10.97,33.98 Q1.X2
N$9
  Bottom 0.152: IC13.1 45.72,75.89 48.01,75.89 48.31,76.2 R64.1 48.31,76.35 48.31,82.6 49.23,83.52 49.23,89 48.31,89.92 48.31,90.83 R41.2
N$10
  Bottom 0.152: R35.1 30.18,31.55 30.18,34.14 C27.1
N$11  (via drill 0.3)
  Top 0.152: v41.6,59.44 41.6,51.82 46.33,47.09 v46.63,47.09 | v45.26,37.19 45.26,35.81 43.89,34.44 43.89,29.41 41.15,26.67 41.15,10.97 36.12,5.94 J6.TIP
  Bottom 0.152: v41.6,59.44 41.6,60.35 R18.1 | v46.63,47.09 47.85,45.87 47.85,39.78 v45.26,37.19
N$12
  Bottom 0.152: R31.1 14.17,76.96 14.48,77.27 17.22,77.27 IC8.6 17.37,77.42 18.44,77.42 18.9,76.96 18.9,74.07 18.59,73.76 18.59,70.41 20.42,68.58 20.42,67.51 IC10.4
N$13  (via drill 0.3)
  Top 0.152: v37.49,78.18 v40.84,74.83
  Bottom 0.152: 40.69,74.83 41,74.52 41,68.89 R39.2 | 40.69,74.83 40.39,75.13 40.08,75.13 IC13.7 | 36.42,78.18 36.42,77.88 C31.2 36.42,78.18 | 36.42,78.18 35.66,78.94 35.66,86.56 R40.1 | v40.84,74.83 40.69,74.83 | 36.42,78.18 v37.49,78.18
N$14  (via drill 0.3)
  Top 0.152: v37.49,78.94 43.43,73 43.43,70.56 40.54,67.67 40.54,64.77 R15.P$1
  Bottom 0.152: IC13.6 40.08,74.52 40.39,74.52 40.69,74.22 40.69,69.95 39.32,68.58 39.32,65.84 40.39,64.77 R15.P$1 | 46.48,90.83 48.01,89.31 48.01,88.24 R42.1 | 46.48,90.83 R41.1 46.48,90.83 | 46.48,90.83 45.72,90.83 44.04,89.15 39.93,89.15 37.95,87.17 R40.2 37.8,87.02 36.58,85.8 36.58,79.55 C31.1 36.58,79.4 37.03,78.94 v37.49,78.94
N$15
  Bottom 0.152: R50.2 29.72,75.44 29.72,77.42 29.57,77.57 R49.1 29.41,77.72 26.82,77.72 C39.1 26.67,77.72 26.36,78.03 23.01,78.03 IC8.2
N$16
  Bottom 0.152: IC8.1 23.01,78.79 26.21,78.79 26.67,79.25 C39.2 26.82,79.4 27.74,80.31 | 27.74,80.31 27.74,81.38 R48.1 | 27.74,80.31 28.65,79.4 29.41,79.4 R49.2
N$17
  Bottom 0.152: IC7.7 17.22,106.07 15.24,106.07 14.48,106.83 C23.2 14.33,106.83 12.04,106.83 | 12.04,106.83 R28.1 12.04,106.83 | 12.04,106.83 12.04,103.33 R29.2
N$18
  Bottom 0.152: R34.1 19.36,29.87 20.88,29.87 C22.1
N$19
  Bottom 0.152: IC7.2 23.01,105.92 23.62,105.92 25.76,103.78 C38.1 25.91,103.78 28.8,103.78 R43.1 28.96,103.63 32,103.63 32.77,102.87 36.12,102.87 | R47.2 36.12,98.45 36.12,100.74 R46.2 36.12,100.89 36.12,102.87 | R44.2 36.12,106.22 36.12,103.94 R45.2 36.12,103.78 36.12,102.87
N$20  (via drill 0.3)
  Top 0.152: v20.27,98.3 20.27,85.04 21.64,83.67 v21.64,76.81
  Bottom 0.152: R32.1 17.22,98.45 IC9.6 17.37,98.3 v20.27,98.3 | v21.64,76.81 21.64,76.05 22.4,75.29 22.4,71.48 22.1,71.17 21.49,71.17 20.57,72.08 20.57,72.54 IC10.13
N$21
  Bottom 0.152: R29.1 13.87,103.33 13.87,104.7 14.33,105.16 C23.1 14.48,105.31 17.22,105.31 IC7.6 17.37,105.46 17.68,105.46 19.51,107.29 R30.2 | R30.2
N$22
  Bottom 0.152: R53.2 30.79,97.23 R52.1 28.35,97.23 25.76,97.23 C40.1 25.6,97.23 23.77,99.06 23.01,99.06 IC9.2
N$23
  Bottom 0.152: R51.1 28.35,101.35 28.35,99.06 R52.2 28.35,98.91 25.76,98.91 C40.2 25.6,98.91 24.84,99.67 23.01,99.67 IC9.1
N$24
  Bottom 0.152: IC11.6 17.22,91.29 14.94,91.29 14.78,91.14 R37.1 14.63,90.98 14.63,87.02 13.87,86.26 13.87,83.52 15.24,82.14 24.38,82.14 24.84,82.6 28.04,82.6 30.63,80.01 30.63,74.68 26.21,70.26 20.57,70.26 19.36,71.48 19.36,72.54 IC10.12
N$25
  Bottom 0.152: R16.2 42.22,91.14 42.22,96.93 41.91,97.23 LED6.A
N$26
  Bottom 0.152: IC11.2 23.01,92.2 25.6,92.2 25.91,92.51 C44.1 26.06,92.51 27.28,91.29 | 27.28,91.29 27.28,90.53 R60.2 | 27.28,91.29 28.5,92.51 28.96,92.51 R59.1
N$27
  Bottom 0.152: IC11.1 23.01,92.81 24.38,92.81 25.91,94.34 C44.2 26.06,94.34 28.96,94.34 R59.2 29.11,94.34 32.16,91.29 33.53,91.29 R58.1
N$28
  Bottom 0.152: R56.1 26.36,63.09 26.36,60.35 C43.1
N$29
  Bottom 0.152: 28.5,105.77 28.5,107.29 R30.1 | 28.5,105.77 28.8,105.46 R43.2 28.5,105.77 | IC7.1 23.01,106.68 24.54,106.68 25.76,105.46 C38.2 25.91,105.46 26.21,105.77 28.5,105.77
N$30  (via drill 0.3)
  Top 0.152: v17.22,82.75 17.22,77.88 v18.29,76.81 | v19.2,69.04 v17.37,70.87
  Bottom 0.152: 16.46,84.28 15.09,84.28 14.94,84.12 R38.1 | 16.46,84.28 17.22,84.28 IC12.6 | 16.46,84.28 16.46,83.52 v17.22,82.75 | v18.29,76.81 18.29,74.83 17.37,73.91 v17.37,70.87 | v19.2,69.04 19.2,67.51 IC10.5
N$31
  Bottom 0.152: IC6.3 47.24,28.8 46.79,28.8 45.72,27.74 45.72,23.01 R65.2 45.57,23.01 43.43,23.01 R27.1
N$32
  Bottom 0.152: R63.2 30.02,83.97 30.02,85.65 29.72,85.95 R62.1 29.57,86.11 26.52,86.11 C46.1 26.36,86.11 25.45,85.19 23.01,85.19 IC12.2
N$33
  Bottom 0.152: 29.26,88.24 29.26,90.37 R61.1 | 29.26,88.24 29.57,87.94 R62.2 29.26,88.24 | IC12.1 23.01,85.8 24.38,85.8 26.36,87.78 C46.2 26.52,87.94 26.82,88.24 29.26,88.24
N$34
  Top 0.152: J1.NORM 10.82,5.94 11.58,5.94 18.44,12.8 18.44,18.29 42.98,42.82 45.87,42.82 S1.2
N$35
  Bottom 0.152: R13.2 22.4,53.95 22.4,56.39 22.55,56.54 LED5.RED
N$36
  Bottom 0.152: R12.2 24.99,53.95 24.99,56.39 25.15,56.54 LED5.BLU
N$37
  Bottom 0.152: R11.2 27.28,54.1 27.28,55.78 26.52,56.54 LED5.GRN
N$38
  Bottom 0.152: R7.2 33.98,86.26 33.98,87.94 33.38,88.54 R3.5
N$39
  Bottom 0.152: IC3.2 13.56,55.32 13.56,55.78 11.43,57.91 9.45,57.91 8.38,58.98 R19.1
N$40  (via drill 0.3)
  Top 0.152: v26.82,73.3 v26.82,80.47 | v26.82,69.49 v26.82,71.63 | v32.16,55.17 30.79,53.8 30.79,44.96 v30.33,44.5 | v23.16,32 17.22,26.06 v17.22,23.32
  Bottom 0.152: v26.82,80.47 26.21,81.08 26.21,81.38 R48.2 | v26.82,71.63 v26.82,73.3 | v26.82,69.49 30.18,66.14 30.18,63.09 33.38,59.89 33.38,56.39 v32.16,55.17 | v30.33,44.5 30.33,39.17 v23.16,32 | v17.22,23.32 8.08,23.32 7.47,22.71 7.47,21.03 2.44,16 J8.TIP
N$41
  Bottom 0.152: IC3.3 14.17,55.32 14.17,57.3 12.5,58.98 R20.1
N$42
  Top 0.152: S1.3 45.87,40.23 45.87,34.75 45.26,34.14 JP1.2
N$43
  Bottom 0.152: IC3.4 14.78,55.32 14.78,57.15 16.31,58.67 16.31,58.98 R21.1
N$44
  Bottom 0.152: 42.52,5.94 42.52,4.42 Q2.C | 42.52,5.94 42.52,7.32 R24.2 42.37,7.47 41.45,8.38 39.17,8.38 R25.1 | 42.52,5.94 48.01,5.94 J12.TIP
N$45
  Bottom 0.152: IC3.5 15.24,55.32 16.31,56.39 16.31,56.54 17.68,57.91 19.51,57.91 20.27,58.67 20.27,58.98 R22.1
N$46
  Bottom 0.152: R8.2 33.38,75.44 33.38,77.88 R4.5
N$47
  Bottom 0.152: R23.2 45.72,2.44 43.74,2.44 43.59,2.29 Q2.B
N$48  (via drill 0.3)
  Top 0.152: v19.51,85.04 v21.03,83.52
  Bottom 0.152: R38.2 14.94,85.65 15.39,85.19 17.22,85.19 IC12.7 17.37,85.04 v19.51,85.04 | v21.03,83.52 21.34,83.21 24.08,83.21 24.69,83.82 28.35,83.82 R63.1
N$49  (via drill 0.3)
  Top 0.152: v25.45,101.5 25.45,101.96 19.51,107.9 2.74,107.9 0.46,105.61 0.46,23.01 v5.33,18.14
  Bottom 0.152: v25.45,101.5 26.52,101.5 R51.2 | v5.33,18.14 7.01,18.14 10.36,14.78 13.72,14.78 14.78,15.85 J9.TIP
N$50  (via drill 0.3)
  Top 0.152: v37.19,50.44 37.19,49.38 v39.32,47.24 | v43.28,45.57 44.81,44.04 47.09,44.04 47.85,43.28 47.85,35.97 46.48,34.59 46.48,17.53 48.01,16 J11.TIP
  Bottom 0.152: v37.19,50.44 37.19,54.56 37.03,54.71 37.03,66.14 36.12,67.06 36.12,72.54 34.9,73.76 34.9,83.06 33.22,84.73 33.22,86.72 30.94,89 30.94,90.37 R61.2 | v39.32,47.24 41.6,47.24 v43.28,45.57
N$51  (via drill 0.3)
  Top 0.152: v35.51,78.33 33.53,76.35 v29.11,76.35 | v28.96,73.76 28.96,64.31 30.18,63.09 30.18,62.48 v29.87,62.18 | v31.55,44.5 v31.55,53.8
  Bottom 0.152: v35.51,78.33 35.36,78.49 35.36,91.14 R58.2 | v29.11,76.35 29.11,73.91 v28.96,73.76 | v29.87,62.18 29.87,59.44 31.55,57.76 v31.55,53.8 | v31.55,44.5 31.55,39.93 34.29,37.19 34.29,29.57 35.2,28.65 35.2,28.04 35.97,27.28 36.73,27.28 39.47,24.54 39.47,19.36 36.12,16 J10.TIP
N$52
  Bottom 0.152: R9.2 33.22,64.77 33.22,67.36 R5.5
N$56
  Top 0.152: JP2.1 47.24,61.27 44.81,61.27 JP2.2
  Bottom 0.152: P1.2 38.71,61.57 40.69,61.57 41,61.27 44.65,61.27 JP2.2
N$64
  Top 0.152: JP2.9 47.24,51.21 44.81,51.21 JP2.10
  Bottom 0.152: P2.2 39.93,48.62 42.22,48.62 44.65,51.05 JP2.10
PAN
  Top 0.152: J5.NORM 39.62,26.06 37.49,26.06 36.27,27.28 28.96,27.28 27.74,26.06 J4.NORM
  Bottom 0.152: J4.NORM 23.47,25.91 J3.NORM 23.32,26.06 20.73,26.06 20.57,26.21 16.76,26.21 15.39,24.84 11.89,24.84 J2.NORM 10.67,25.91 10.21,25.91 7.16,22.86 7.16,21.64 6.4,20.88 5.79,20.88 1.22,16.31 1.22,15.39 2.29,14.33 2.29,5.94 J1.TIP
POT_CH1  (via drill 0.3)
  Top 0.152: v10.67,36.58 10.67,32.16 8.99,30.48 8.99,19.36 11.89,16.46 11.89,9.45 9.75,7.32 9.75,5.33 12.5,2.59 34.75,2.59 46.94,14.78 48.62,14.78 49.53,15.7 49.53,65.68 43.74,71.48 43.74,73.46 36.12,81.08 32.61,81.08 29.26,84.43 29.26,96.93 23.93,102.26 23.93,103.02 20.42,106.53 3.35,106.53 R2.1
  Bottom 0.152: v10.67,36.58 10.67,37.95 UC1.10
POT_CH2  (via drill 0.3)
  Top 0.152: v5.18,43.74 v5.18,40.84 | v6.25,46.02 6.25,46.33 6.86,46.94 11.89,46.94 14.33,44.5 14.63,44.5 15.09,44.96 15.09,49.23 8.08,56.24 v8.08,57.45
  Bottom 0.152: v5.18,40.84 7.16,38.86 10.06,38.86 10.21,38.71 10.21,38.1 UC1.11 | v5.18,43.74 4.88,44.04 4.88,45.26 5.64,46.02 v6.25,46.02 | v8.08,57.45 7.77,57.45 7.01,58.22 5.94,58.22 1.98,62.18 1.98,94.79 3.2,96.01 R3.1
POT_CH3  (via drill 0.3)
  Top 0.152: v5.94,38.25 5.03,38.25 v4.72,37.95 | v8.08,48.77 8.84,48.77 v9.3,49.23 | v3.96,56.84 3.96,64.92 1.98,66.9 1.98,84.12 3.2,85.34 R4.1
  Bottom 0.152: v5.94,38.25 9.3,38.25 9.45,38.1 9.75,38.1 UC1.12 | v4.72,37.95 4.72,38.25 2.44,40.54 2.44,48.31 2.9,48.77 4.57,48.77 4.88,48.46 7.77,48.46 v8.08,48.77 | v9.3,49.23 9.3,55.02 7.47,56.84 v3.96,56.84
POT_CH4  (via drill 0.3)
  Top 0.152: v6.55,40.69 6.55,44.04 5.03,45.57 v5.03,49.07 | v7.47,51.51 7.47,59.44 v9.75,61.72
  Bottom 0.152: v6.55,40.69 7.62,39.62 8.23,39.62 UC1.13 | v7.47,51.51 v5.03,49.07 | v9.75,61.72 9.75,68.43 3.35,74.83 R5.1
POT_FRAME
  Bottom 0.152: UC1.15 8.38,40.54 14.17,40.54 15.85,38.86 22.4,38.86 24.38,40.84 R14.P$2
RESET  (via drill 0.3)
  Top 0.152: v12.04,36.42 11.58,36.42 10.82,37.19 9.45,37.19 9.3,37.03 v4.88,37.03
  Bottom 0.152: v12.04,36.42 12.19,36.58 12.19,37.95 UC1.7 | v4.88,37.03 1.68,40.23 1.68,49.07 | 1.68,49.07 1.68,49.99 JP4.10 | 1.68,49.07 4.12,49.07 6.86,51.82 6.86,53.03 7.77,53.95 7.77,55.02 R1.1
VCA0_1  (via drill 0.3)
  Top 0.152: v20.12,75.44 v23.01,75.44
  Bottom 0.152: R31.2 14.63,78.18 17.22,78.18 IC8.7 17.37,78.03 18.29,78.03 20.12,76.2 v20.12,75.44 | v23.01,75.44 28.04,75.44 R50.1
VCA0_3
  Bottom 0.152: R37.2 14.78,92.66 15.24,92.2 17.22,92.2 IC11.7 17.37,92.05 18.14,92.05 19.96,90.22 24.08,90.22 24.23,90.37 25.6,90.37 R60.1
VCA_1  (via drill 0.3)
  Top 0.152: v23.01,102.56 23.01,101.8 19.66,98.45 19.66,85.95 16.61,82.91 16.61,76.2 4.57,64.16 4.57,53.8 4.12,53.34 v4.12,26.52 | v6.55,24.08 6.55,20.12 10.67,16 J8.NORM
  Bottom 0.152: v23.01,102.56 31.55,102.56 34.59,99.52 34.59,98.3 35.36,97.54 36.73,97.54 36.88,97.69 36.88,104.39 37.64,105.16 37.64,106.22 R44.1 | v6.55,24.08 v4.12,26.52
VCA_2  (via drill 0.3)
  Top 0.152: v37.8,91.59 37.8,80.31 45.57,72.54 45.57,70.41 v46.18,69.8 | v46.18,66.75 44.04,64.62 44.04,62.18 43.59,61.72 43.59,50.6 v44.96,49.23 | v43.28,47.55 43.28,46.33 25.76,28.8 25.76,26.36 v19.51,20.12
  Bottom 0.152: v37.8,91.59 37.8,98.3 R47.1 | v46.18,66.75 v46.18,69.8 | v43.28,47.55 v44.96,49.23 | v19.51,20.12 19.51,19.81 19.81,19.51 19.81,17.53 21.34,16 23.32,16 J9.NORM
VCA_3  (via drill 0.3)
  Top 0.152: v37.8,99.52 37.8,92.35 37.19,91.75 37.19,80.47 44.96,72.69 v44.96,71.02 | v44.96,68.73 48.62,65.08 48.62,50.6 v46.18,48.16 | v30.94,35.2 v42.67,46.94
  Bottom 0.152: v37.8,99.52 37.8,100.74 R46.1 | v44.96,68.73 v44.96,71.02 | v46.18,48.16 44.65,48.16 43.43,46.94 v42.67,46.94 | v30.94,35.2 30.94,30.94 29.72,29.72 29.41,29.72 29.26,29.57 29.26,28.19 31.24,26.21 33.68,26.21 33.98,25.91 33.98,20.73 32.92,19.66 32.92,13.41 33.53,12.8 33.53,12.5 33.07,12.04 31.24,12.04 27.74,15.54 27.74,15.85 J10.NORM
VCA_4  (via drill 0.3)
  Top 0.152: v39.01,90.37 39.01,79.86 v39.93,78.94 | v38.25,75.29 38.25,73.76 36.42,71.93 36.42,63.25 31.24,58.06 v30.02,58.06
  Bottom 0.152: v39.01,90.37 39.01,101.04 37.8,102.26 37.8,103.78 R45.1 | v39.93,78.94 39.93,76.96 v38.25,75.29 | v30.02,58.06 30.02,50.14 34.75,45.41 34.75,38.86 37.95,35.66 45.41,35.66 46.48,34.59 46.48,28.96 42.52,24.99 42.52,18.75 39.78,16 J11.NORM
VCC  (via drill 0.3)
  Top 0.152: v11.28,97.08 12.5,97.08 v13.41,96.16 17.53,92.05 v19.05,92.05 v19.05,89.92 13.26,84.12 v13.26,80.16 | v37.64,74.68 37.64,73.61 36.42,72.39 | 36.42,72.39 35.81,71.78 v35.81,63.4 34.59,63.4 v29.26,58.06 | v30.94,20.12 33.22,20.12 37.95,24.84 40.08,24.84 40.84,25.6 40.84,28.65 v40.08,29.41 | v26.21,72.69 27.13,72.69 28.8,74.37 34.44,74.37 36.42,72.39
  Bottom 0.152: 13.41,79.4 11.73,77.72 11.73,66.6 C26.1 | 13.41,79.4 15.54,79.4 16.15,78.79 17.22,78.79 IC8.8 17.37,78.64 18.14,78.64 20.73,76.05 20.73,74.68 19.96,73.91 19.96,71.32 20.73,70.56 23.77,70.56 24.23,71.02 24.23,72.54 IC10.16 24.38,72.69 v26.21,72.69 | 11.12,97.08 11.12,96.93 10.21,96.01 C25.1 | 11.12,97.08 11.12,107.44 11.43,107.75 14.94,107.75 15.85,106.83 17.22,106.83 IC7.8 | IC12.8 17.37,85.8 17.37,86.72 19.05,88.39 C30.1 19.05,88.54 v19.05,89.92 | 18.14,92.96 20.57,95.4 C29.1 | 18.14,92.96 17.98,92.81 17.37,92.81 IC11.8 | 18.14,92.96 v19.05,92.05 | 17.37,100.58 17.37,99.82 IC9.8 | 17.37,100.58 18.75,101.96 C35.1 | 17.37,100.58 17.07,100.89 13.56,100.89 13.41,100.74 v13.41,96.16 8.99,91.75 8.99,86.11 C24.1 | v11.28,97.08 11.12,97.08 | 13.41,79.4 13.41,80.01 v13.26,80.16 | 16.61,17.07 16.61,18.29 16.46,18.44 IC1.3 | 16.61,17.07 16.61,12.65 | 16.61,12.65 16.61,9.75 25.3,1.07 42.06,1.07 42.37,1.37 42.37,3.05 42.22,3.2 40.69,3.2 37.49,6.4 37.49,8.38 R25.2 | 16.61,12.65 21.64,12.65 27.43,18.44 29.26,18.44 IC4.3 29.41,18.59 v30.94,20.12 | 16.61,17.07 14.48,17.07 14.33,16.92 11.73,16.92 9.3,19.36 9.3,21.79 C11.+ | 39.93,33.07 39.32,32.46 39.32,30.33 R26.1 39.32,30.18 v40.08,29.41 | 39.93,33.07 42.22,35.36 43.13,35.36 43.89,34.59 43.89,33.53 41.6,31.24 41.6,30.33 IC6.8 | 37.8,74.83 36.58,76.05 C34.1 | 37.8,74.83 37.95,74.68 38.41,74.68 39.47,75.74 39.93,75.74 IC13.8 | v37.64,74.68 37.8,74.83 | v35.81,63.4 35.81,61.72 P1.1 35.66,61.57 35.66,58.98 D1.C 35.66,58.83 35.51,58.67 35.51,53.8 C4.+ | 39.93,33.07 32.77,40.23 32.77,46.94 29.26,50.44 v29.26,58.06
VEE  (via drill 0.3)
  Top 0.152: v21.03,81.38 v21.03,78.33 21.03,76.66 | 23.93,81.08 23.93,78.33 21.79,76.2 21.49,76.2 21.03,76.66 | 23.93,81.08 v23.93,83.82 v23.93,90.83 23.01,91.75 v23.01,96.47 23.62,97.08 23.62,102.72 23.01,103.33 v22.86,103.33 | 15.54,72.24 16.15,72.24 20.57,76.66 21.03,76.66 | 15.54,72.24 v13.87,72.24 | 15.54,72.24 v15.54,71.02 | 41.76,72.85 v42.82,72.85 | 41.76,72.85 33.83,80.77 27.28,80.77 26.98,81.08 23.93,81.08 | v35.97,49.23 35.97,52.58 v37.8,54.41 | v37.8,59.89 37.8,65.38 41.76,69.34 41.76,72.85
  Bottom 0.152: IC6.4 47.4,28.35 47.85,28.35 48.92,29.41 48.92,34.59 47.55,35.97 40.23,35.97 36.58,39.62 C21.- 36.58,39.78 36.88,40.08 36.88,44.81 D2.A 37.03,44.96 37.03,48.46 P2.1 36.88,48.62 36.58,48.62 v35.97,49.23 | C36.2 16.31,95.86 16,95.86 14.33,94.18 14.17,94.18 10.67,90.68 10.67,86.11 C28.2 10.67,85.95 10.67,83.52 C41.2 10.67,83.36 10.97,83.36 13.26,81.08 17.53,81.08 C47.2 17.68,81.08 17.98,81.08 18.75,81.84 20.57,81.84 v21.03,81.38 21.79,81.38 22.1,81.08 C37.2 | 43.74,71.93 45.57,73.76 IC13.4 | 43.74,71.93 C48.2 43.74,71.93 | v21.03,78.33 22.55,76.81 22.86,76.81 IC8.4 | v23.93,83.82 23.01,83.82 IC12.4 | v23.93,90.83 23.01,90.83 IC11.4 | IC9.4 23.01,97.69 v23.01,96.47 24.23,95.25 33.38,95.25 38.86,89.76 42.52,89.76 43.13,90.37 43.13,91.59 43.43,91.9 47.09,91.9 47.4,91.59 47.4,90.37 48.92,88.85 48.92,87.63 48.16,86.87 48.16,86.56 R42.2 | v22.86,103.33 22.86,104.7 IC7.4 | v13.87,72.24 13.11,73 C45.2 | v15.54,71.02 15.54,72.54 IC10.9 | v42.82,72.85 43.74,71.93 | v37.8,59.89 v37.8,54.41

## Text on the board
bPlace: 2018 - V3.0 | Mod by Codex Modulex | CC-BY-SA-3.0 | Original design by Olivier Gillet
bNames: µSlices